# Altium schematic sheet MotorDriver.SchDoc
size A; SheetNumber: 3; SheetTotal: 4
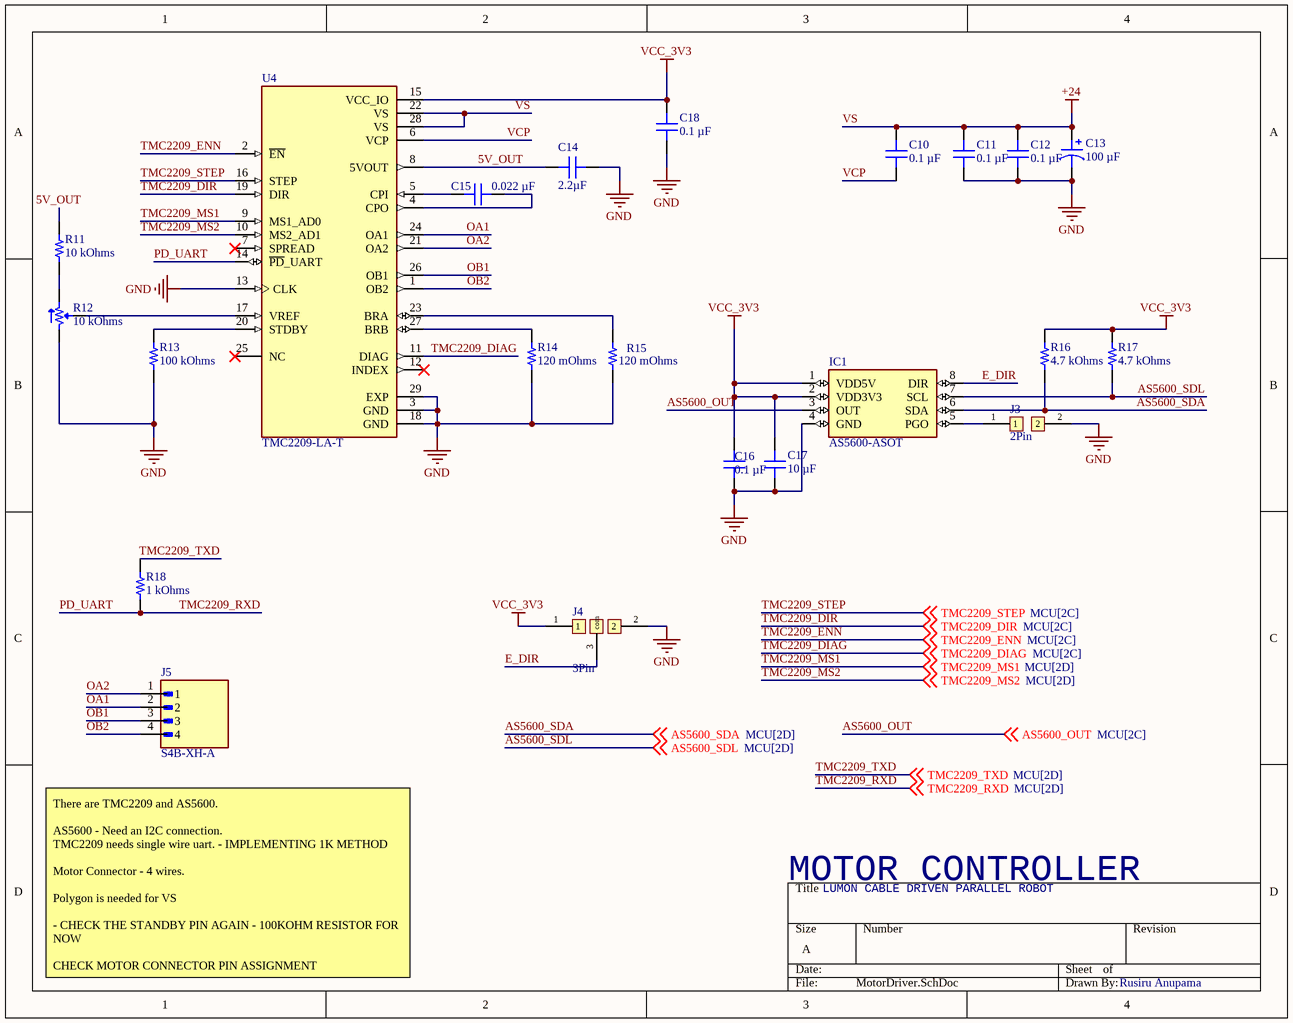
[diagram p0: MotorDriver.SchDoc]

## Parts
C10  0.1 µF  [CAP 0805_2012]
C11  0.1 µF  [CAP 0805_2012]
C12  0.1 µF  [CAP 0805_2012]
C13  100 µF  [CAP ALSMD 8.3MM H10.5MM]
C14  2.2µF  [CAP 0805_2012]
C15  0.022 µF  [CAP 0805_2012]
C16  0.1 µF  [CAP 0805_2012]
C17  10 µF  [CAP 0805_2012]
C18  0.1 µF  [CAP 0805_2012]
IC1  AS5600-ASOT  [SOIC127P600X175-8N]
J3  2Pin  [2Pin]
J4  3Pin  [Solder_Bridge]
J5  S4B-XH-A  [JST_S4B-XH-A]
R11  10 kOhms  [RES 0805_2012]
R12  10 kOhms  [POT BOURNS TRIMPOT TC33]
R13  100 kOhms  [RES 0805_2012]
R14  120 mOhms  [RES 1206_3216]
R15  120 mOhms  [RES 1206_3216]
R16  4.7 kOhms  [RES 0805_2012]
R17  4.7 kOhms  [RES 0805_2012]
R18  1 kOhms  [RES 0805_2012]
U4  TMC2209-LA-T  [QFN50P500X500X90-29N]

## Nets
GND: C11.1 C12.1 C13.2 C14.2 C16.1 C17.1 C18.1 IC1.4(GND) J3.2 J4.2 R12.1 R13.1 R14.1 R15.1 U4.3(GND) U4.13(CLK) U4.18(GND) U4.29(EXP)
VCC_3V3: C16.2 C17.2 C18.2 IC1.1(VDD5V) IC1.2(VDD3V3) J4.1 R16.2 R17.2 U4.15(VCC_IO)
VS: C10.1 C11.2 C12.2 C13.1 U4.22(VS) U4.28(VS)  [also labelled +24]
5V_OUT: C14.1 R11.2 U4.8(5VOUT)
AS5600_OUT: IC1.3(OUT) ; off-sheet AS5600_OUT
AS5600_SDA: IC1.6(SDA) R16.1 ; off-sheet AS5600_SDA
AS5600_SDL: IC1.7(SCL) R17.1 ; off-sheet AS5600_SDL
E_DIR: IC1.8(DIR) J4.3(com)
OA1: J5.2 U4.24(OA1)
OA2: J5.1 U4.21(OA2)
OB1: J5.3 U4.26(OB1)
OB2: J5.4 U4.1(OB2)
PD_UART: R18.1 U4.14(~{PD}_UART) ; off-sheet TMC2209_RXD  [also labelled TMC2209_RXD]
TMC2209_DIAG: U4.11(DIAG) ; off-sheet TMC2209_DIAG
TMC2209_DIR: U4.19(DIR) ; off-sheet TMC2209_DIR
TMC2209_ENN: U4.2(~{EN}) ; off-sheet TMC2209_ENN
TMC2209_MS1: U4.9(MS1_AD0) ; off-sheet TMC2209_MS1
TMC2209_MS2: U4.10(MS2_AD1) ; off-sheet TMC2209_MS2
TMC2209_STEP: U4.16(STEP) ; off-sheet TMC2209_STEP
TMC2209_TXD: R18.2 ; off-sheet TMC2209_TXD
VCP: C10.2 U4.6(VCP)
NetC15_1: C15.1 U4.4(CPO)
NetC15_2: C15.2 U4.5(CPI)
NetIC1_5: IC1.5(PGO) J3.1
NetR11_1: R11.1 R12.3
NetR12_2: R12.2 U4.17(VREF)
NetR13_2: R13.2 U4.20(STDBY)
NetR14_2: R14.2 U4.27(BRB)
NetR15_2: R15.2 U4.23(BRA)

Not connected (* = marked no-connect by the designer): U4 7(SPREAD)* 12(INDEX)* 25(NC)*

## Notes on the sheet
- MOTOR CONTROLLER
- LUMON CABLE DRIVEN PARALLEL ROBOT
- There are TMC2209 and AS5600.
  AS5600 - Need an I2C connection.
  TMC2209 needs single wire uart. - IMPLEMENTING 1K METHOD
  Motor Connector - 4 wires.
  Polygon is needed for VS
  - CHECK THE STANDBY PIN AGAIN - 100KOHM RESISTOR FOR NOW
  CHECK MOTOR CONNECTOR PIN ASSIGNMENT
- Rusiru Anupama

## Library data of the parts
C10-C12 C16 C18 = CC0805MRX7R9BB104: CAP CER 0.1UF 50V X7R 0805; manufacturer: Yageo; Tolerance: ±20%; Part Number: CC0805MRX7R9BB104; Capacitance: 0.1 µF; Applications: General Purpose; componentlink1description: Datasheet; componentlink1url: https://www.yageo.com/upload/media/product/productsearch/datasheet/mlcc/UPY-GPHC_X7R_6.3V-to-50V_18.pdf; componentlink2description: DigiKey Link; componentlink2url: https://www.digikey.com/en/products/detail/yageo/CC0805MRX7R9BB104/5884281; Device Package: 0805 (2012 Metric); lastupdated: 4/6/2026 7:33:19 PM; Lifecycle Status: Active; Minimum Order: 1; Mounting Type: Surface Mount, MLCC; Operating Temperature: -55°C ~ 125°C; Package / Case: 0805 (2012 Metric); packaging: TapeAndReel; partid: 2475; Part Status: Active; price: 0.01; series: CC; Size / Dimension: 0.079" L x 0.049" W (2.00mm x 1.25mm); Supplier 1: DigiKey; Supplier Part Number 1: 311-4351-1-ND; Temperature Coefficient: X7R; Thickness (Max): 0.037" (0.95mm); value: 0.1 µF; Voltage - Rated: 50V; LCSC part #: C49678
C13 = 50SKV100M8X10.5: CAP ALUM 100UF 20% 50V SMD; manufacturer: Rubycon; Lifetime @ Temp.: 1000 Hrs @ 105°C; Polarization: Polar; Ripple Current @ High Frequency: 240 mA @ 10 kHz; Ripple Current @ Low Frequency: 200 mA @ 120 Hz; Surface Mount Land Size: 0.327" L x 0.327" W (8.30mm x 8.30mm); Part Number: 50SKV100M8X10.5; Applications: General Purpose; Capacitance: 100 µF; componentlink1description: Datasheet; componentlink1url: http://www.rubycon.co.jp/en/catalog/e_pdfs/aluminum/e_SKV.pdf; componentlink2description: DigiKey Link; componentlink2url: https://www.digikey.com/en/products/detail/rubycon/50SKV100M8X10-5/3568726; Device Package: Radial, Can - SMD; Height - Seated (Max): 0.413" (10.50mm); lastupdated: 4/5/2026 8:53:56 PM; Lifecycle Status: Active; Minimum Order: 1; Mounting Type: Surface Mount; Operating Temperature: -55°C ~ 105°C; Package / Case: Radial, Can - SMD; packaging: TapeAndReel; partid: 7600; Part Status: Active; price: 0.17; series: SKV; Size / Dimension: 0.315" Dia (8.00mm); Supplier 1: DigiKey; Supplier Part Number 1: 1189-3108-1-ND; Tolerance: ±20%; value: 100 µF; Voltage - Rated: 50 V; LCSC part #: C2983550
C14 = 0805YD225KAT2A: CAP CER 2.2UF 16V X5R 0805; manufacturer: AVX Corporation; Tolerance: ±10%; Part Number: 0805YD225KAT2A; Capacitance: 2.2µF; Applications: General Purpose; componentlink1description: Datasheet; componentlink1url: http://datasheets.avx.com/cx5r.pdf; componentlink2description: DigiKey Link; componentlink2url: http://digikey.com/product-detail/en/avx-corporation/0805YD225KAT2A/478-2580-1-ND/717525; Device Package: 0805 (2012 Metric); lastupdated: 9/2/2020 1:04:40 AM; Lifecycle Status: Active; Minimum Order: 1; Mounting Type: Surface Mount, MLCC; Operating Temperature: -55°C ~ 85°C; Package / Case: 0805 (2012 Metric); packaging: TapeAndReel; partid: 3362; Part Status: Active; price: 0.16; series: -; Size / Dimension: 0.079" L x 0.049" W (2.01mm x 1.25mm); Supplier 1: DigiKey; Supplier Part Number 1: 478-2580-1-ND; Temperature Coefficient: X5R; Thickness (Max): 0.055" (1.40mm); value: 2.2µF; Voltage - Rated: 16V; LCSC part #: C377773
C15 = C0805X223K5REC7210: CAP CER 0805 22NF 50V X7R 10%; manufacturer: KEMET; Part Number: C0805X223K5REC7210; Capacitance: 0.022 µF; Applications: Boardflex Sensitive, ESD Protection; componentlink1description: Datasheet; componentlink1url: https://api.kemet.com/component-edge/download/datasheet/C0805X223K5REC7210.pdf; componentlink2description: DigiKey Link; componentlink2url: https://www.digikey.com/en/products/detail/kemet/C0805X223K5REC7210/8652064; Device Package: 0805 (2012 Metric); Features: Soft Termination; lastupdated: 4/6/2026 7:31:59 PM; Lifecycle Status: Active; Minimum Order: 1; Mounting Type: Surface Mount, MLCC; Operating Temperature: -55°C ~ 125°C; Package / Case: 0805 (2012 Metric); packaging: TapeAndReel; partid: 32185; Part Status: Active; price: 0.05; series: ESD SMD Comm X7R; Size / Dimension: 0.079" L x 0.049" W (2.00mm x 1.25mm); Supplier 1: DigiKey; Supplier Part Number 1: 399-C0805X223K5REC7210CT-ND; Temperature Coefficient: X7R; Thickness (Max): 0.039" (0.98mm); Tolerance: ±10%; value: 0.022 µF; Voltage - Rated: 50V; LCSC part #: C77069
C17 = CL21Y106KPQVPNE: CAP CER 10UF 10V X7S 0805; manufacturer: Samsung Electro-Mechanics; Tolerance: ±10%; Part Number: CL21Y106KPQVPNE; Capacitance: 10 µF; Applications: Automotive; componentlink1description: Datasheet; componentlink1url: http://www.samsungsem.com/kr/support/product-search/mlcc/CL21Y106KPQVPNE.jsp; componentlink2description: DigiKey Link; componentlink2url: https://www.digikey.com/en/products/detail/samsung-electro-mechanics/CL21Y106KPQVPNE/5961169; Device Package: 0805 (2012 Metric); Features: General Purpose; lastupdated: 4/6/2026 7:33:17 PM; Lifecycle Status: Active; Minimum Order: 1; Mounting Type: Surface Mount, MLCC, Epoxy; Operating Temperature: -55°C ~ 125°C; Package / Case: 0805 (2012 Metric); packaging: TapeAndReel; partid: 2979; Part Status: Active; price: 0.06; Ratings: AEC-Q200; series: CL; Size / Dimension: 0.079" L x 0.049" W (2.00mm x 1.25mm); Supplier 1: DigiKey; Supplier Part Number 1: 1276-6685-1-ND; Temperature Coefficient: X7S; Thickness (Max): 0.055" (1.40mm); value: 10 µF; Voltage - Rated: 10V; LCSC part #: C32635
IC1 = AS5600-ASOT: Hall Effect Sensor Angle External Magnet, Not Included Gull Wing; LSCS part #: C499458; MF: ams; SnapEDA_Link: https://www.snapeda.com/parts/AS5600-ASOT/ams/view-part/?ref=snap; Package: SOIC-8 ams; Value: *; MP: AS5600-ASOT; Check_prices: https://www.snapeda.com/parts/AS5600-ASOT/ams/view-part/?ref=eda; LCSC part #: C499458
R11 = CPF0805B10KE: RES SMD 10K OHM 0.1% 1/10W 0805; Manufacturer: TE Connectivity Passive Product; Power (Watts): 0.1W, 1/10W; Temperature Coefficient: ±25ppm/°C; Part Number: CPF0805B10KE; Value: 10 kOhms; ComponentLink1Description: Datasheet; ComponentLink1URL: https://www.te.com/commerce/DocumentDelivery/DDEController?Action=srchrtrv&DocNm=1773200&DocType=DS&DocLang=English; ComponentLink2Description: DigiKey Link; ComponentLink2URL: https://www.digikey.com/en/products/detail/te-connectivity-passive-product/CPF0805B10KE/2389790; Composition: Thin Film; Device Package: 0805 (2012 Metric); Height - Seated (Max): 0.026" (0.65mm); LastUpdated: 4/5/2026 8:11:26 PM; Lifecycle Status: Active; Minimum Order: 1; Number of Terminations: 2; Operating Temperature: -55°C ~ 155°C; Package / Case: 0805 (2012 Metric); Packaging: TapeAndReel; PartId: 27724; Part Status: Active; Price: 0.09; Resistance: 10 kOhms; Series: CPF, Neohm; Size / Dimension: 0.079" L x 0.049" W (2.00mm x 1.25mm); Supplier 1: DigiKey; Supplier Part Number 1: A106043CT-ND; Supplier Device Package: 0805; Tolerance: ±0.1%; LCSC part #: C84376
R12 = TC33X-2-103E: TRIMMER 10K OHM 0.15W J LEAD TOP; Manufacturer: Bourns Inc.; Adjustment Type: Top Adjustment; Number of Turns: 1.0; Resistive Material: Cermet; Temperature Coefficient: ±250ppm/°C; Tolerance: ±25%; Part Number: TC33X-2-103E; ComponentLink1Description: Datasheet; ComponentLink1URL: https://www.bourns.com/docs/Product-Datasheets/TC33.pdf; ComponentLink2Description: DigiKey Link; ComponentLink2URL: https://www.digikey.com/en/products/detail/bourns-inc/TC33X-2-103E/612858; LastUpdated: 4/5/2026 8:40:53 PM; Lifecycle Status: Active; Minimum Order: 1; Mounting Type: Surface Mount; Packaging: TapeAndReel; PartId: 8; Part Status: Active; Power (Watts): 0.15W; Price: 0.11; Resistance: 10 kOhms; Series: Trimpot® TC33 - Open Frame; Size / Dimension: Rectangular - 0.150" x 0.142" Face (3.80mm x 3.60mm); Supplier 1: DigiKey; Supplier Part Number 1: TC33X-103ECT-ND; Termination Style: J Lead; Value: 10 kOhms; LCSC part #: C719176
R13 = RCS0805100KFKEA: RES SMD 100K OHM 1% 1/2W 0805; Manufacturer: Vishay Dale; Power (Watts): 0.5W, 1/2W; Temperature Coefficient: ±100ppm/°C; Part Number: RCS0805100KFKEA; Value: 100 kOhms; ComponentLink1Description: Datasheet; ComponentLink1URL: http://www.vishay.com/docs/20065/rcse3.pdf; ComponentLink2Description: DigiKey Link; ComponentLink2URL: https://www.digikey.com/en/products/detail/vishay-dale/RCS0805100KFKEA/5866996; Composition: Thick Film; Device Package: 0805 (2012 Metric); Features: Automotive AEC-Q200, Pulse Withstanding; Height - Seated (Max): 0.020" (0.50mm); LastUpdated: 4/5/2026 8:11:26 PM; Lifecycle Status: Active; Minimum Order: 1; Number of Terminations: 2; Operating Temperature: -55°C ~ 155°C; Package / Case: 0805 (2012 Metric); Packaging: TapeAndReel; PartId: 27789; Part Status: Active; Price: 0.02; Ratings: AEC-Q200; Resistance: 100 kOhms; Series: RCS e3; Size / Dimension: 0.079" L x 0.049" W (2.00mm x 1.25mm); Supplier 1: DigiKey; Supplier Part Number 1: 541-2850-1-ND; Supplier Device Package: 0805; Tolerance: ±1%; LCSC part #: C122537
R14 R15 = KRL1632E-M-R120-F-T5: RES 0.12 OHM 1% 3/4W 1206; Manufacturer: Susumu; Power (Watts): 0.75W, 3/4W; Temperature Coefficient: ±50ppm/°C; Part Number: KRL1632E-M-R120-F-T5; ComponentLink1Description: Datasheet; ComponentLink1URL: http://www.susumu.co.jp/common/pdf/n_catalog_partition09_en.pdf; ComponentLink2Description: DigiKey Link; ComponentLink2URL: https://www.digikey.com/en/products/detail/susumu/KRL1632E-M-R120-F-T5/3738009; Composition: Metal Foil; Device Package: 1206 (3216 Metric); Features: Automotive AEC-Q200, Current Sense; Height - Seated (Max): 0.028" (0.70mm); LastUpdated: 4/6/2026 8:00:54 PM; Lifecycle Status: Active; Minimum Order: 1; Number of Terminations: 2; Operating Temperature: -55°C ~ 155°C; Package / Case: 1206 (3216 Metric); Packaging: TapeAndReel; PartId: 26840; Part Status: Active; Price: 0.09; Ratings: AEC-Q200; Resistance: 120 mOhms; Series: KRL; Size / Dimension: 0.126" L x 0.063" W (3.20mm x 1.60mm); Supplier 1: DigiKey; Supplier Part Number 1: 408-1583-1-ND; Supplier Device Package: 1206; Tolerance: ±1%; Value: 120 mOhms; LCSC part #: C6356569
R16 R17 = RCS08054K70JNEA: RES SMD 4.7K OHM 5% 1/2W 0805; Manufacturer: Vishay Dale; Power (Watts): 0.5W, 1/2W; Temperature Coefficient: ±200ppm/°C; Part Number: RCS08054K70JNEA; Value: 4.7 kOhms; ComponentLink1Description: Datasheet; ComponentLink1URL: http://www.vishay.com/docs/20065/rcse3.pdf; ComponentLink2Description: DigiKey Link; ComponentLink2URL: https://www.digikey.com/en/products/detail/vishay-dale/RCS08054K70JNEA/5867012; Composition: Thick Film; Device Package: 0805 (2012 Metric); Features: Automotive AEC-Q200, Pulse Withstanding; Height - Seated (Max): 0.020" (0.50mm); LastUpdated: 4/5/2026 8:11:26 PM; Lifecycle Status: Active; Minimum Order: 1; Number of Terminations: 2; Operating Temperature: -55°C ~ 155°C; Package / Case: 0805 (2012 Metric); Packaging: TapeAndReel; PartId: 27839; Part Status: Active; Price: 0.02; Ratings: AEC-Q200; Resistance: 4.7 kOhms; Series: RCS e3; Size / Dimension: 0.079" L x 0.049" W (2.00mm x 1.25mm); Supplier 1: DigiKey; Supplier Part Number 1: 541-2866-1-ND; Supplier Device Package: 0805; Tolerance: ±5%; LCSC part #: C865532
R18 = RNCS0805BKE1K00: RES 1K OHM 0.1% 1/10W 0805; Manufacturer: Stackpole Electronics Inc; Power (Watts): 0.1W, 1/10W; Temperature Coefficient: ±25ppm/°C; Part Number: RNCS0805BKE1K00; Value: 1 kOhms; ComponentLink1Description: Datasheet; ComponentLink1URL: https://www.seielect.com/catalog/sei-rncs_rnch.pdf; ComponentLink2Description: DigiKey Link; ComponentLink2URL: https://www.digikey.com/en/products/detail/stackpole-electronics-inc/RNCS0805BKE1K00/1800073; Composition: Thin Film; Device Package: 0805 (2012 Metric); Features: Anti-Corrosive, Automotive AEC-Q200, Moisture Resistant; Height - Seated (Max): 0.026" (0.65mm); LastUpdated: 4/5/2026 8:11:26 PM; Lifecycle Status: Active; Minimum Order: 1; Number of Terminations: 2; Operating Temperature: -55°C ~ 155°C; Package / Case: 0805 (2012 Metric); Packaging: TapeAndReel; PartId: 27715; Part Status: Active; Price: 0.08; Ratings: AEC-Q200; Resistance: 1 kOhms; Series: RNCS; Size / Dimension: 0.079" L x 0.049" W (2.00mm x 1.25mm); Supplier 1: DigiKey; Supplier Part Number 1: RNCS0805BKE1K00CT-ND; Supplier Device Package: 0805; Tolerance: ±0.1%; LCSC part #: C441981
U4 = TMC2209-LA-T: Bipolar Motor Driver Power MOSFET Step/Direction, UART 28-QFN (5x5); MF: Trinamic Motion Control GmbH; SnapEDA_Link: https://www.snapeda.com/parts/TMC2209-LA-T/Trinamic/view-part/?ref=snap; Package: VFQFN-28 Trinamic; Value: *; MP: TMC2209-LA-T; Check_prices: https://www.snapeda.com/parts/TMC2209-LA-T/Trinamic/view-part/?ref=eda; LCSC part #: C2150710
J5 = S4B-XH-A: Package: None; Price: None; Value: *; MP: S4B-XH-A; Availability: Unavailable; LCSC part #: C19271397